# EAGLE design Robot_Psoc (EAGLE 7.5.0)
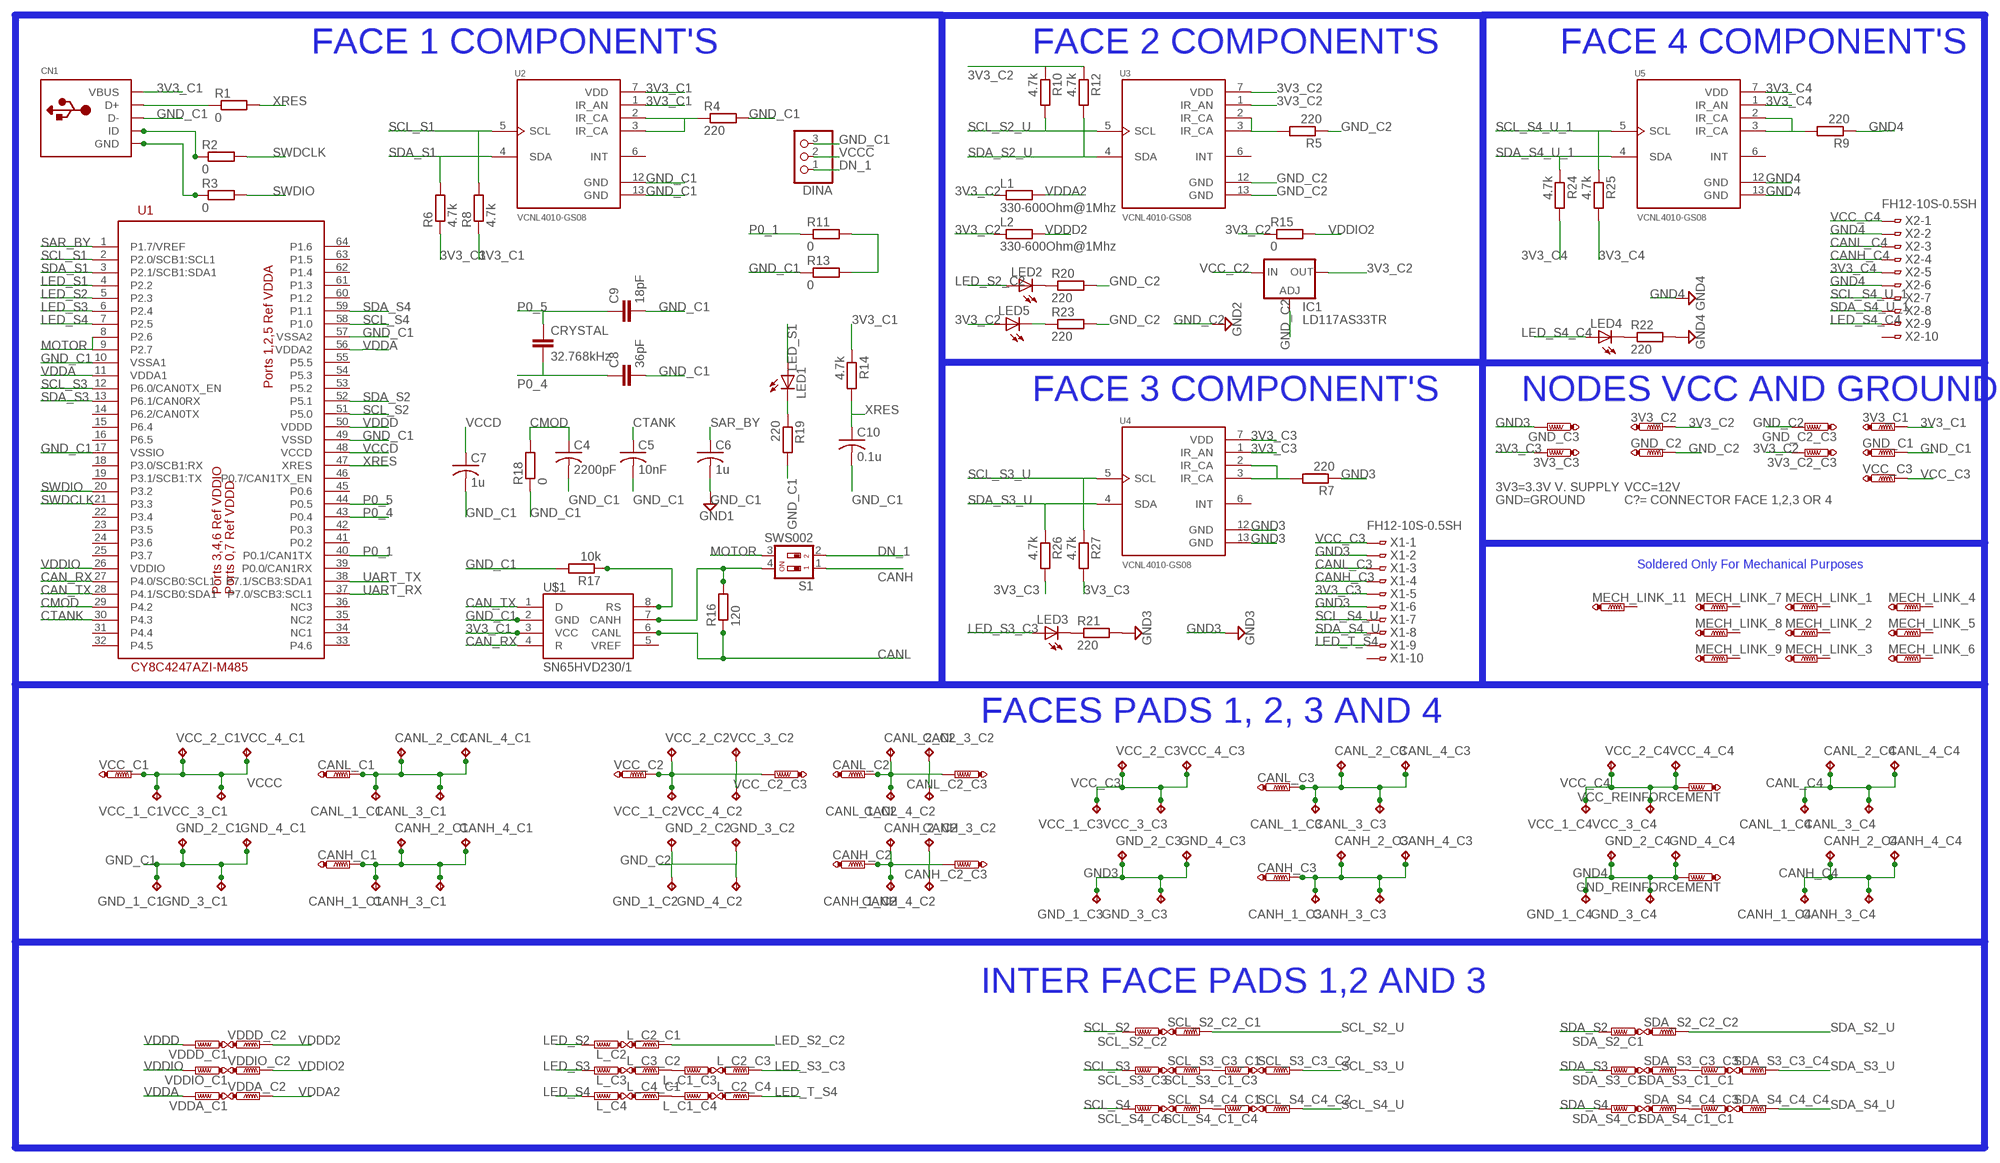
[diagram p0: schematic, sheet 1]

## Parts
3V3_C1  PTR1TP11R  [TP11R]
3V3_C2  PTR1TP11R  [TP11R]
3V3_C2_C3  PTR1TP11R  [TP11R]
3V3_C3  PTR1TP11R  [TP11R]
C4  2200pF  C-USC0805  [C0805]
C5  10nF  C-USC0805  [C0805]
C6  1u  C-USC0805  [C0805]
C7  1u  C-USC0805  [C0805]
C8  36pF  C-EUC0805  [C0805]
C9  18pF  C-EUC0805  [C0805]
C10  0.1u  C-USC0805  [C0805]
CANH_1_C1  TPB2,54  [B2,54]
CANH_1_C2  TPB2,54  [B2,54]
CANH_1_C3  TPB2,54  [B2,54]
CANH_1_C4  TPB2,54  [B2,54]
CANH_2_C1  TPB2,54  [B2,54]
CANH_2_C2  TPB2,54  [B2,54]
CANH_2_C3  TPB2,54  [B2,54]
CANH_2_C4  TPB2,54  [B2,54]
CANH_3_C1  TPB2,54  [B2,54]
CANH_3_C2  TPB2,54  [B2,54]
CANH_3_C3  TPB2,54  [B2,54]
CANH_3_C4  TPB2,54  [B2,54]
CANH_4_C1  TPB2,54  [B2,54]
CANH_4_C2  TPB2,54  [B2,54]
CANH_4_C3  TPB2,54  [B2,54]
CANH_4_C4  TPB2,54  [B2,54]
CANH_C1  PTR1TP11R  [TP11R]
CANH_C2  PTR1TP11R  [TP11R]
CANH_C2_C3  PTR1TP11R  [TP11R]
CANH_C3  PTR1TP11R  [TP11R]
CANL_1_C1  TPB2,54  [B2,54]
CANL_1_C2  TPB2,54  [B2,54]
CANL_1_C3  TPB2,54  [B2,54]
CANL_1_C4  TPB2,54  [B2,54]
CANL_2_C1  TPB2,54  [B2,54]
CANL_2_C2  TPB2,54  [B2,54]
CANL_2_C3  TPB2,54  [B2,54]
CANL_2_C4  TPB2,54  [B2,54]
CANL_3_C1  TPB2,54  [B2,54]
CANL_3_C2  TPB2,54  [B2,54]
CANL_3_C3  TPB2,54  [B2,54]
CANL_3_C4  TPB2,54  [B2,54]
CANL_4_C1  TPB2,54  [B2,54]
CANL_4_C2  TPB2,54  [B2,54]
CANL_4_C3  TPB2,54  [B2,54]
CANL_4_C4  TPB2,54  [B2,54]
CANL_C1  PTR1TP11R  [TP11R]
CANL_C2  PTR1TP11R  [TP11R]
CANL_C2_C3  PTR1TP11R  [TP11R]
CANL_C3  PTR1TP11R  [TP11R]
CN1  USBMINIB  [USB-MINIB]
CRYSTAL  32.768kHz  C-EUC0603  [C0603]
DINA  PINHD-1X3  [1X03]
GND_1_C1  TPB2,54  [B2,54]
GND_1_C2  TPB2,54  [B2,54]
GND_1_C3  TPB2,54  [B2,54]
GND_1_C4  TPB2,54  [B2,54]
GND_2_C1  TPB2,54  [B2,54]
GND_2_C2  TPB2,54  [B2,54]
GND_2_C3  TPB2,54  [B2,54]
GND_2_C4  TPB2,54  [B2,54]
GND_3_C1  TPB2,54  [B2,54]
GND_3_C2  TPB2,54  [B2,54]
GND_3_C3  TPB2,54  [B2,54]
GND_3_C4  TPB2,54  [B2,54]
GND_4_C1  TPB2,54  [B2,54]
GND_4_C2  TPB2,54  [B2,54]
GND_4_C3  TPB2,54  [B2,54]
GND_4_C4  TPB2,54  [B2,54]
GND_C1  PTR1TP11R  [TP11R]
GND_C2  PTR1TP11R  [TP11R]
GND_C2_C3  PTR1TP11R  [TP11R]
GND_C3  PTR1TP11R  [TP11R]
GND_REINFORCEMENT  PTR1TP11R  [TP11R]
IC1  LD117AS33TR  [SOT223]
L1  330-600Ohm@1Mhz  R-EU_R0805  [R0805]
L2  330-600Ohm@1Mhz  R-EU_R0805  [R0805]
L_C1_C3  PTR1TP11R  [TP11R]
L_C1_C4  PTR1TP11R  [TP11R]
L_C2  PTR1TP11R  [TP11R]
L_C2_C1  PTR1TP11R  [TP11R]
L_C2_C3  PTR1TP11R  [TP11R]
L_C2_C4  PTR1TP11R  [TP11R]
L_C3  PTR1TP11R  [TP11R]
L_C3_C2  PTR1TP11R  [TP11R]
L_C4  PTR1TP11R  [TP11R]
L_C4_C1  PTR1TP11R  [TP11R]
LED1  LEDCHIPLED_0805  [CHIPLED_0805]
LED2  LEDCHIPLED_0805  [CHIPLED_0805]
LED3  LEDCHIPLED_0805  [CHIPLED_0805]
LED4  LEDCHIPLED_0805  [CHIPLED_0805]
LED5  LEDCHIPLED_0805  [CHIPLED_0805]
MECH_LINK_1  PTR1TP11R  [TP11R]
MECH_LINK_2  PTR1TP11R  [TP11R]
MECH_LINK_3  PTR1TP11R  [TP11R]
MECH_LINK_4  PTR1TP11R  [TP11R]
MECH_LINK_5  PTR1TP11R  [TP11R]
MECH_LINK_6  PTR1TP11R  [TP11R]
MECH_LINK_7  PTR1TP11R  [TP11R]
MECH_LINK_8  PTR1TP11R  [TP11R]
MECH_LINK_9  PTR1TP11R  [TP11R]
MECH_LINK_11  PTR1TP11R  [TP11R]
R1  0  R-EU_R0805  [R0805]
R2  0  R-EU_R0805  [R0805]
R3  0  R-EU_R0805  [R0805]
R4  220  R-EU_R0805  [R0805]
R5  220  R-EU_R0805  [R0805]
R6  4.7k  R-EU_R0805  [R0805]
R7  220  R-EU_R0805  [R0805]
R8  4.7k  R-EU_R0805  [R0805]
R9  220  R-EU_R0805  [R0805]
R10  4.7k  R-EU_R0805  [R0805]
R11  0  R-EU_R0805  [R0805]
R12  4.7k  R-EU_R0805  [R0805]
R13  0  R-EU_R0805  [R0805]
R14  4.7k  R-EU_R0805  [R0805]
R15  0  R-EU_R0805  [R0805]
R16  120  R-EU_R0805  [R0805]
R17  10k  R-EU_R0805  [R0805]
R18  0  R-EU_R0805  [R0805]
R19  220  R-EU_R0805  [R0805]
R20  220  R-EU_R0805  [R0805]
R21  220  R-EU_R0805  [R0805]
R22  220  R-EU_R0805  [R0805]
R23  220  R-EU_R0805  [R0805]
R24  4.7k  R-EU_R0805  [R0805]
R25  4.7k  R-EU_R0805  [R0805]
R26  4.7k  R-EU_R0805  [R0805]
R27  4.7k  R-EU_R0805  [R0805]
S1  SWS002  [SMS-002]
SCL_S2_C2  PTR1TP11R  [TP11R]
SCL_S2_C2_C1  PTR1TP11R  [TP11R]
SCL_S3_C1_C3  PTR1TP11R  [TP11R]
SCL_S3_C3  PTR1TP11R  [TP11R]
SCL_S3_C3_C1  PTR1TP11R  [TP11R]
SCL_S3_C3_C2  PTR1TP11R  [TP11R]
SCL_S4_C1_C4  PTR1TP11R  [TP11R]
SCL_S4_C4  PTR1TP11R  [TP11R]
SCL_S4_C4_C1  PTR1TP11R  [TP11R]
SCL_S4_C4_C2  PTR1TP11R  [TP11R]
SDA_S2_C1  PTR1TP11R  [TP11R]
SDA_S2_C2_C2  PTR1TP11R  [TP11R]
SDA_S3_C1  PTR1TP11R  [TP11R]
SDA_S3_C1_C1  PTR1TP11R  [TP11R]
SDA_S3_C3_C3  PTR1TP11R  [TP11R]
SDA_S3_C3_C4  PTR1TP11R  [TP11R]
SDA_S4_C1  PTR1TP11R  [TP11R]
SDA_S4_C1_C1  PTR1TP11R  [TP11R]
SDA_S4_C4_C3  PTR1TP11R  [TP11R]
SDA_S4_C4_C4  PTR1TP11R  [TP11R]
U1  CY8C4247AZI-M485  [TQFP64-10X10]
U2  VCNL4010-GS08  [XDCR_VCNL4010-GS08]
U3  VCNL4010-GS08  [XDCR_VCNL4010-GS08]
U4  VCNL4010-GS08  [XDCR_VCNL4010-GS08]
U5  VCNL4010-GS08  [XDCR_VCNL4010-GS08]
U$1  SN65HVD230/1  [SO8]
VCC_1_C1  TPB2,54  [B2,54]
VCC_1_C2  TPB2,54  [B2,54]
VCC_1_C3  TPB2,54  [B2,54]
VCC_1_C4  TPB2,54  [B2,54]
VCC_2_C1  TPB2,54  [B2,54]
VCC_2_C2  TPB2,54  [B2,54]
VCC_2_C3  TPB2,54  [B2,54]
VCC_2_C4  TPB2,54  [B2,54]
VCC_3_C1  TPB2,54  [B2,54]
VCC_3_C2  TPB2,54  [B2,54]
VCC_3_C3  TPB2,54  [B2,54]
VCC_3_C4  TPB2,54  [B2,54]
VCC_4_C1  TPB2,54  [B2,54]
VCC_4_C2  TPB2,54  [B2,54]
VCC_4_C3  TPB2,54  [B2,54]
VCC_4_C4  TPB2,54  [B2,54]
VCC_C1  PTR1TP11R  [TP11R]
VCC_C2  PTR1TP11R  [TP11R]
VCC_C2_C3  PTR1TP11R  [TP11R]
VCC_C3  PTR1TP11R  [TP11R]
VCC_REINFORCEMENT  PTR1TP11R  [TP11R]
VDDA_C1  PTR1TP11R  [TP11R]
VDDA_C2  PTR1TP11R  [TP11R]
VDDD_C1  PTR1TP11R  [TP11R]
VDDD_C2  PTR1TP11R  [TP11R]
VDDIO_C1  PTR1TP11R  [TP11R]
VDDIO_C2  PTR1TP11R  [TP11R]
X1  FH12-10S-0.5SH  [FH12-10S-0.5SH]
X2  FH12-10S-0.5SH  [FH12-10S-0.5SH]

## Nets
3V3_C1: 3V3_C1.TP CN1.VBUS R6.1 R8.1 R14.1 U2.1(IR_AN) U2.7(VDD) U$1.3(VCC)
3V3_C2: 3V3_C2.TP 3V3_C2_C3.TP IC1.4(OUT) L1.1 L2.1 LED5.A R10.1 R12.1 R15.1 U3.1(IR_AN) U3.7(VDD)
3V3_C3: 3V3_C3.TP R26.2 R27.2 U4.1(IR_AN) U4.7(VDD) X1.5
3V3_C4: R24.2 R25.2 U5.1(IR_AN) U5.7(VDD) X2.5
CAN_RX: U1.27(P4.0/SCB0:SCL1) U$1.4(R)
CAN_TX: U1.28(P4.1/SCB0:SDA1) U$1.1(D)
CANH: CANH_1_C1.TP CANH_2_C1.TP CANH_3_C1.TP CANH_4_C1.TP CANH_C1.TP S1.1
CANH_C3: CANH_1_C3.TP CANH_2_C3.TP CANH_3_C3.TP CANH_4_C3.TP CANH_C3.TP X1.4
CANH_C4: CANH_1_C4.TP CANH_2_C4.TP CANH_3_C4.TP CANH_4_C4.TP X2.4
CANL: CANL_1_C1.TP CANL_2_C1.TP CANL_3_C1.TP CANL_4_C1.TP CANL_C1.TP R16.1 U$1.6(CANL)
CANL_C3: CANL_1_C3.TP CANL_2_C3.TP CANL_3_C3.TP CANL_4_C3.TP CANL_C3.TP X1.3
CANL_C4: CANL_1_C4.TP CANL_2_C4.TP CANL_3_C4.TP CANL_4_C4.TP X2.3
CMOD: C4.1 R18.2 U1.29(P4.2)
CTANK: C5.1 U1.30(P4.3)
DN_1: DINA.1 S1.2
GND3: GND_1_C3.TP GND_2_C3.TP GND_3_C3.TP GND_4_C3.TP GND_C3.TP R7.1 R21.2 U4.12(GND) U4.13(GND) X1.2 X1.6
GND4: GND_1_C4.TP GND_2_C4.TP GND_3_C4.TP GND_4_C4.TP GND_REINFORCEMENT.TP R9.1 R22.2 U5.12(GND) U5.13(GND) X2.2 X2.6
GND_C1: C4.2 C5.2 C6.2 C7.2 C8.2 C9.2 C10.2 CN1.D- DINA.3 GND_1_C1.TP GND_2_C1.TP GND_3_C1.TP GND_4_C1.TP GND_C1.TP R4.2 R13.1 R17.2 R18.1 R19.2 U1.10(VSSA1) U1.17(VSSIO) U1.49(VSSD) U1.57(VSSA2) U2.12(GND) U2.13(GND) U$1.2(GND) ; supply symbol labelled GND1
GND_C2: GND_1_C2.TP GND_2_C2.TP GND_3_C2.TP GND_4_C2.TP GND_C2.TP GND_C2_C3.TP IC1.1(ADJ) R5.1 R20.2 R23.2 U3.12(GND) U3.13(GND) ; supply symbol labelled GND2
LED_S1: LED1.A U1.4(P2.2)
LED_S2: L_C2.TP U1.5(P2.3)
LED_S2_C2: L_C2_C1.TP LED2.A
LED_S3: L_C3.TP U1.6(P2.4)
LED_S3_C3: L_C2_C3.TP LED3.A
LED_S4: L_C4.TP U1.7(P2.5)
LED_S4_C4: LED4.A X2.9
LED_T_S4: L_C2_C4.TP X1.9
MOTOR: S1.3 U1.8(P2.6) U1.9(P2.7)
N$1: CN1.D+ R1.1
N$2: CN1.ID R2.1
N$3: CN1.GND R3.1
N$4: R11.2 R13.2
N$5: R16.2 S1.4 U$1.7(CANH)
N$7: CANH_1_C2.TP CANH_2_C2.TP CANH_3_C2.TP CANH_4_C2.TP CANH_C2.TP CANH_C2_C3.TP
N$8: R7.2 U4.2(IR_CA) U4.3(IR_CA)
N$9: R17.1 U$1.8(RS)
N$10: SDA_S3_C1_C1.TP SDA_S3_C3_C3.TP
N$14: LED1.C R19.1
N$15: LED2.C R20.1
N$16: LED3.C R21.1
N$17: LED4.C R22.1
N$18: LED5.C R23.1
N$20: L_C1_C4.TP L_C4_C1.TP
N$21: R4.1 U2.2(IR_CA) U2.3(IR_CA)
N$22: L_C1_C3.TP L_C3_C2.TP
N$26: SCL_S3_C1_C3.TP SCL_S3_C3_C1.TP
N$27: SCL_S4_C1_C4.TP SCL_S4_C4_C1.TP
N$32: CANL_1_C2.TP CANL_2_C2.TP CANL_3_C2.TP CANL_4_C2.TP CANL_C2.TP CANL_C2_C3.TP
N$43: R5.2 U3.2(IR_CA) U3.3(IR_CA)
N$44: SDA_S4_C1_C1.TP SDA_S4_C4_C3.TP
N$46: R9.2 U5.2(IR_CA) U5.3(IR_CA)
P0_1: R11.1 U1.40(P0.1/CAN1TX)
P0_4: C8.1 CRYSTAL.2 U1.43(P0.4)
P0_5: C9.1 CRYSTAL.1 U1.44(P0.5)
SAR_BY: C6.1 U1.1(P1.7/VREF)
SCL_S1: R8.2 U1.2(P2.0/SCB1:SCL1) U2.5(SCL)
SCL_S2: SCL_S2_C2.TP U1.51(P5.0)
SCL_S2_U: R10.2 SCL_S2_C2_C1.TP U3.5(SCL)
SCL_S3: SCL_S3_C3.TP U1.12(P6.0/CAN0TX_EN)
SCL_S3_U: R27.1 SCL_S3_C3_C2.TP U4.5(SCL)
SCL_S4: SCL_S4_C4.TP U1.58(P1.0)
SCL_S4_U: SCL_S4_C4_C2.TP X1.7
SCL_S4_U_1: R25.1 U5.5(SCL) X2.7
SDA_S1: R6.2 U1.3(P2.1/SCB1:SDA1) U2.4(SDA)
SDA_S2: SDA_S2_C1.TP U1.52(P5.1)
SDA_S2_U: R12.2 SDA_S2_C2_C2.TP U3.4(SDA)
SDA_S3: SDA_S3_C1.TP U1.13(P6.1/CAN0RX)
SDA_S3_U: R26.1 SDA_S3_C3_C4.TP U4.4(SDA)
SDA_S4: SDA_S4_C1.TP U1.59(P1.1)
SDA_S4_U: SDA_S4_C4_C4.TP X1.8
SDA_S4_U_1: R24.1 U5.4(SDA) X2.8
SWDCLK: R2.2 U1.21(P3.3)
SWDIO: R3.2 U1.20(P3.2)
UART_RX: U1.37(P7.0/SCB3:SCL1)
UART_TX: U1.38(P7.1/SCB3:SDA1)
VCC_C2: IC1.3(IN) VCC_1_C2.TP VCC_2_C2.TP VCC_3_C2.TP VCC_4_C2.TP VCC_C2.TP VCC_C2_C3.TP
VCC_C3: VCC_1_C3.TP VCC_2_C3.TP VCC_3_C3.TP VCC_4_C3.TP VCC_C3.TP X1.1
VCC_C4: VCC_1_C4.TP VCC_2_C4.TP VCC_3_C4.TP VCC_4_C4.TP VCC_REINFORCEMENT.TP X2.1
VCCC: DINA.2 VCC_1_C1.TP VCC_2_C1.TP VCC_3_C1.TP VCC_4_C1.TP VCC_C1.TP
VCCD: C7.1 U1.48(VCCD)
VDDA: U1.11(VDDA1) U1.56(VDDA2) VDDA_C1.TP
VDDA2: L1.2 VDDA_C2.TP
VDDD: U1.50(VDDD) VDDD_C1.TP
VDDD2: L2.2 VDDD_C2.TP
VDDIO: U1.26(VDDIO) VDDIO_C1.TP
VDDIO2: R15.2 VDDIO_C2.TP
XRES: C10.1 R1.2 R14.2 U1.47(XRES)
Unconnected: MECH_LINK_1.TP MECH_LINK_2.TP MECH_LINK_3.TP MECH_LINK_4.TP MECH_LINK_5.TP MECH_LINK_6.TP MECH_LINK_7.TP MECH_LINK_8.TP MECH_LINK_9.TP MECH_LINK_11.TP U1.14(P6.2/CAN0TX) U1.15(P6.4) U1.16(P6.5) U1.18(P3.0/SCB1:RX) U1.19(P3.1/SCB1:TX) U1.22(P3.4) U1.23(P3.5) U1.24(P3.6) U1.25(P3.7) U1.31(P4.4) U1.32(P4.5) U1.33(P4.6) U1.34(NC1) U1.35(NC2) U1.36(NC3) U1.39(P0.0/CAN1RX) U1.41(P0.2) U1.42(P0.3) U1.45(P0.6) U1.46(P0.7/CAN1TX_EN) U1.53(P5.2) U1.54(P5.3) U1.55(P5.5) U1.60(P1.2) U1.61(P1.3) U1.62(P1.4) U1.63(P1.5) U1.64(P1.6) U2.6(INT) U3.6(INT) U4.6(INT) U5.6(INT) U$1.5(VREF) X1.10 X2.10

## Notes on the sheet
- FACE 1 COMPONENT'S | FACE 2 COMPONENT'S | FACE 4 COMPONENT'S
- FACE 3 COMPONENT'S | NODES VCC AND GROUND
- 3V3=3.3V V. SUPPLY | VCC=12V
- GND=GROUND | C?= CONNECTOR FACE 1,2,3 OR 4
- Soldered Only For Mechanical Purposes
- FACES PADS 1, 2, 3 AND 4
- INTER FACE PADS 1,2 AND 3

## Library data of the parts
3V3_C1 3V3_C2 3V3_C2_C3 3V3_C3 CANH_C1 CANH_C2 CANH_C2_C3 CANH_C3 CANL_C1 CANL_C2 CANL_C2_C3 CANL_C3 GND_C1 GND_C2 GND_C2_C3 GND_C3 GND_REINFORCEMENT L_C1_C3 L_C1_C4 L_C2 L_C2_C1 L_C2_C3 L_C2_C4 L_C3 L_C3_C2 L_C4 L_C4_C1 MECH_LINK_1-MECH_LINK_9 MECH_LINK_11 SCL_S2_C2 SCL_S2_C2_C1 SCL_S3_C1_C3 SCL_S3_C3 SCL_S3_C3_C1 SCL_S3_C3_C2 SCL_S4_C1_C4 SCL_S4_C4 SCL_S4_C4_C1 SCL_S4_C4_C2 SDA_S2_C1 SDA_S2_C2_C2 SDA_S3_C1 SDA_S3_C1_C1 SDA_S3_C3_C3 SDA_S3_C3_C4 SDA_S4_C1 SDA_S4_C1_C1 SDA_S4_C4_C3 SDA_S4_C4_C4 VCC_C1 VCC_C2 VCC_C2_C3 VCC_C3 VCC_REINFORCEMENT VDDA_C1 VDDA_C2 VDDD_C1 VDDD_C2 VDDIO_C1 VDDIO_C2 = testpad:PTR1: TEST PIN
C4-C7 C10 = rcl:C-US: CAPACITOR, American symbol
C8 C9 CRYSTAL = rcl:C-EU: CAPACITOR, European symbol
CANH_1_C1-CANH_1_C4 CANH_2_C1-CANH_2_C4 CANH_3_C1-CANH_3_C4 CANH_4_C1-CANH_4_C4 CANL_1_C1-CANL_1_C4 CANL_2_C1-CANL_2_C4 CANL_3_C1-CANL_3_C4 CANL_4_C1-CANL_4_C4 GND_1_C1-GND_1_C4 GND_2_C1-GND_2_C4 GND_3_C1-GND_3_C4 GND_4_C1-GND_4_C4 VCC_1_C1-VCC_1_C4 VCC_2_C1-VCC_2_C4 VCC_3_C1-VCC_3_C4 VCC_4_C1-VCC_4_C4 = testpad:TP: Test pad
CN1 = adafruit:USB: USB Connectors USBMINIB - Surface Mount Female Mini-B USB Connector 4UConnector: 06564 By microbuilder.eu Thru-hole RA Female Mini-B USB Connector 4UConnector: 18732 By ladyada.net
DINA = pinhead:PINHD-1X3: PIN HEADER
IC1 = v-reg:LD117A?*: Low drop fixed and adjustable positive voltage regulators 1 A Source: http://www.st.com/stonline/products/literature/ds/7194/ld1117axx.pdf
L1 L2 R1-R27 = rcl:R-EU_: RESISTOR, European symbol
LED1-LED5 = adafruit:LED: LED OSRAM: - CHIPLED LG R971, LG N971, LY N971, LG Q971, LY Q971, LO R971, LY R971 LH N974, LH R974 LS Q976, LO Q976, LY Q976 LO Q996 - Hyper CHIPLED LW Q18S LB Q993, LB Q99A, LB R99A - SideLED LS A670, LO A670, LY A670, LG A670, LP A670 LB A673, LV A673, LT A673, LW A673 LH A674 LY A675 LS A676, LA A676, LO A676, LY A676, LW A676 LS A679, LY A679, LG A679 - Hyper Micro SIDELED® LS Y876, LA Y876, LO Y876, LY Y876 LT Y87S - SmartLED LW L88C, LW L88S LB L89C, LB L89S, LG L890 LS L89K, LO L89K, LY L89K LS L896, LA L896, LO L896, LY L896 - TOPLED LS T670, LO T670, LY T670, LG T670, LP T670 LSG T670, LSP T670, LSY T670, LOP T670, LYG T670 LG T671, LOG T671, LSG T671 LB T673, LV T673, LT T673, LW T673 LH T674 LS T676, LA T676, LO T676, LY T676, LB T676, LH T676, LSB T676, LW T676 LB T67C, LV T67C, LT T67C, LS T67K, LO T67K, LY T67K, LW E67C LS E67B, LA E67B, LO E67B, LY E67B, LB E67C, LV E67C, LT E67C LW T67C LS T679, LY T679, LG T679 LS T770, LO T770, LY T770, LG T770, LP T770 LB T773, LV T773, LT T773, LW T773 LH T774 LS E675, LA E675, LY E675, LS T675 LS T776, LA T776, LO T776, LY T776, LB T776 LHGB T686 LT T68C, LB T68C - Hyper Mini TOPLED® LB M676 - Mini TOPLED Santana® LG M470 LS M47K, LO M47K, LY M47K Source: http://www.osram.convergy.de/
S1 = smd-special:SWS002: SMD Dip Switch 2 pol.
U1 = CypressPSoC:CY8C4247AZI-M485
U2-U5 = VCNL4010-GS08:VCNL4010-GS08
U$1 = texas_instruments:SN65HVD230/1
X1 X2 = con-hirose:FH12-10S-0.5S: 0.5mm Pitch Connectors For FPC/FFC Source: Data sheet <http://www.hirose.co.jp/cataloge_hp/e58605370.pdf>; MPN: FH12-10S-0.5SH(55); OC_FARNELL: 1324540; OC_NEWARK: 34M6152

## Board
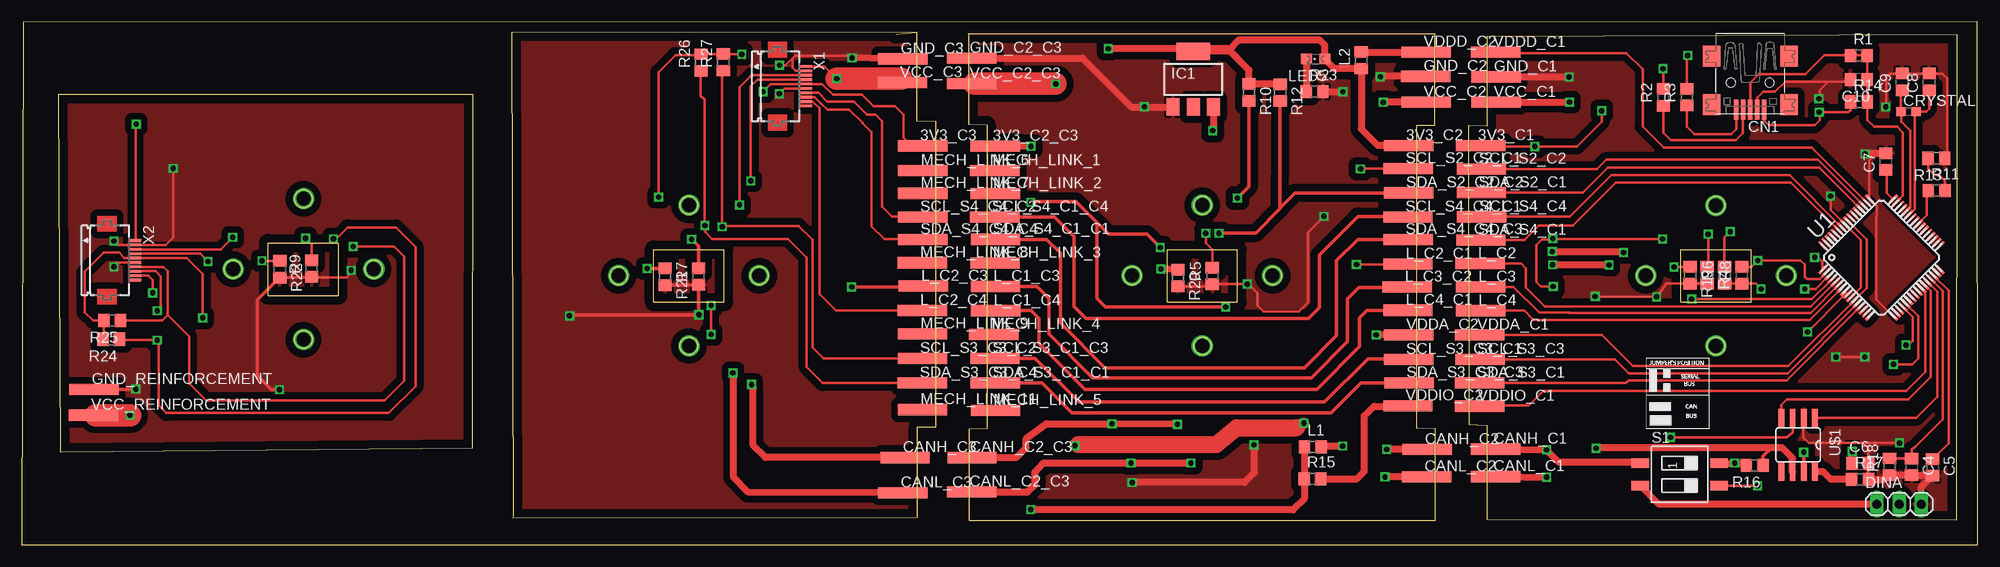
[diagram p1: board, top side]
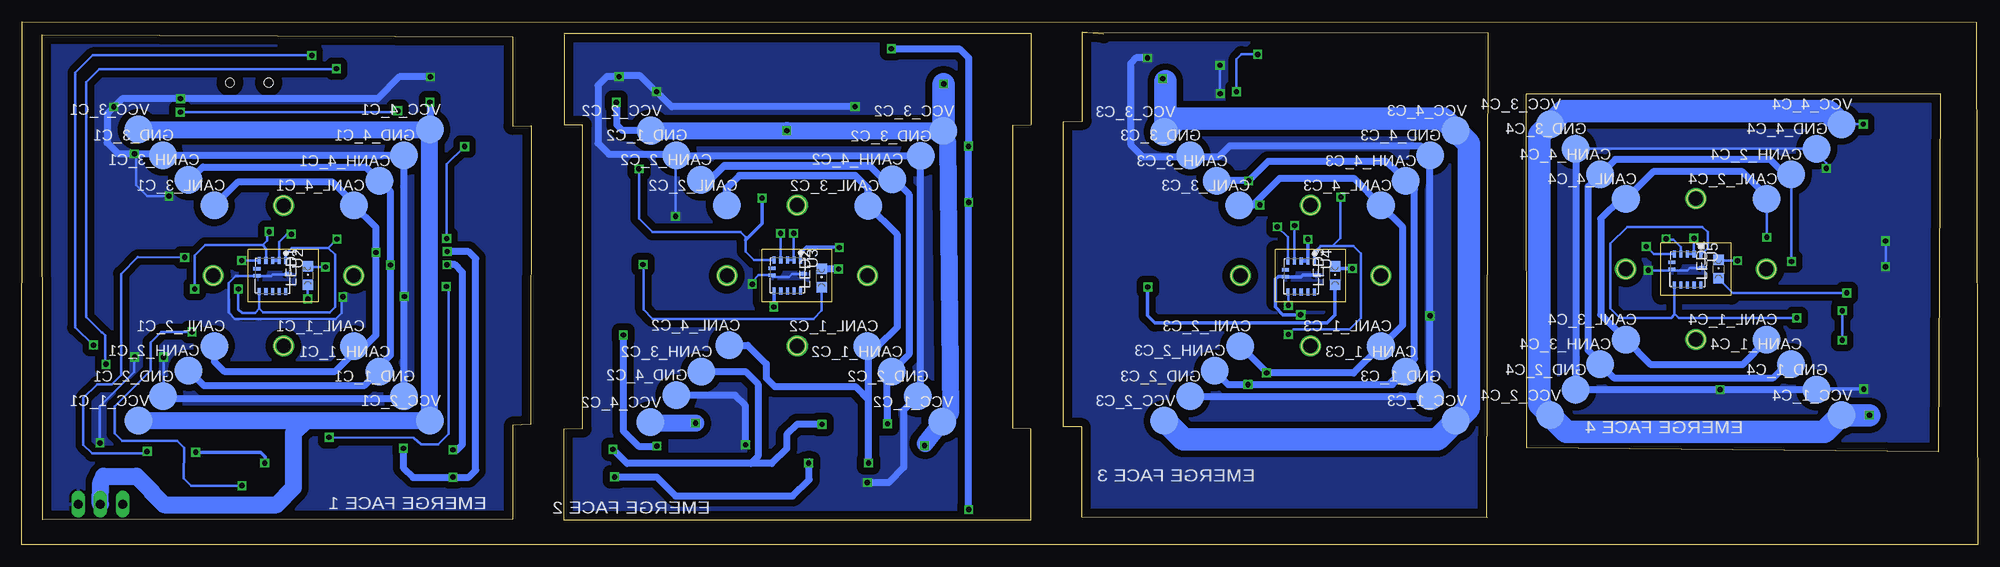
[diagram p2: board, bottom side, seen from below]

Size 222.46 x 59.49 mm. Coordinates in mm from the lower left corner, seen from the top.
Outline: 107.6,58.13 160.77,58.13
Outline: 101.8,58.34 101.8,48.21 103.99,48.13 103.96,13.41 101.88,13.39 101.88,3.1 55.78,3.05
Outline: 99.42,58.09 101.8,58.34
Outline: 101.8,58.34 55.73,58.27 55.85,3.15
Outline: 160.71,58.04 160.71,47.75 158.67,47.75 158.67,13.21 160.81,13.18 160.81,2.77 107.72,2.77 107.72,13.18 109.78,13.21 109.78,47.75 107.67,47.8 107.67,58.09
Outline: 0,0 222.46,0 222.41,59.49 0.15,59.44 0,0
Outline: 138.29,27.61 138.29,33.61 130.29,33.61 130.29,27.61 138.29,27.61
Outline: 4.4,10.55 4.17,51.27 51.35,51.27 51.25,10.98 4.4,10.55
Outline: 36,28.34 36,34.34 28,34.34 28,28.34 36,28.34
Outline: 79.87,27.61 79.87,33.61 71.87,33.61 71.87,27.61 79.87,27.61
Outline: 196.71,27.61 196.71,33.61 188.71,33.61 188.71,27.61 196.71,27.61
Outline: 166.65,47.65 164.54,47.68 164.59,13.67 166.62,13.56 166.62,2.9 220.09,2.79 220.14,58.04 166.65,57.81 166.65,47.65
Outline: circle at 126.29,30.61 radius 1
Outline: circle at 134.29,38.61 radius 1
Outline: circle at 142.29,30.61 radius 1
Outline: circle at 134.29,22.61 radius 1
Outline: circle at 24,31.34 radius 1
Outline: circle at 32,39.34 radius 1
Outline: circle at 40,31.34 radius 1
Outline: circle at 32,23.34 radius 1
Outline: circle at 67.87,30.61 radius 1
Outline: circle at 75.87,38.61 radius 1
Outline: circle at 83.87,30.61 radius 1
Outline: circle at 75.87,22.61 radius 1
Outline: circle at 184.71,30.61 radius 1
Outline: circle at 192.71,38.61 radius 1
Outline: circle at 200.71,30.61 radius 1
Outline: circle at 192.71,22.61 radius 1
Copper layers (1*16): Top 0.035mm / dielectric 1.5mm / Bottom 0.035mm
Design rules "default": minimum track width 10mil, minimum drill 24mil, track to track 8mil, track to pad 8mil, pad to pad 8mil, via to via 8mil, smd to smd 8mil, copper to edge 40mil, drill to drill 8mil, minimum pad ring 10mil, minimum via ring 8mil, stop-mask expansion 4mil, vias tented up to drill 0mil, thermal gap 10mil

### Footprints (pad centres in the part's own frame; a part is rotated, then mirrored left to right if it is on the bottom)
TP11R = smd 0.635 x 1.27: P$1 0.381,0; P$2 1.016,0; P$3 -0.254,0; P$4 -0.889,0; P$5 -1.524,0; P$6 1.613,0; P$7 2.21,0; P$8 -2.146,0; P$9 -2.769,0 | smd 1.1 x 1.1: TP 0,0
C0805 = smd 1.3 x 1.5: 1 -0.95,0; 2 0.95,0
B2,54 = smd 3.175 x 3.175 bottom: P$1 0,0 | smd 2.54 x 2.54 bottom: TP 0,0
USB-MINIB = smd 0.5 x 2.308: D+ 0,4.064; D- -0.8,4.064; GND 1.6,4.064; ID 0.8,4.064; VBUS -1.6,4.064 | smd 2 x 2.4: GND1 -4.4,-2; GND2 -4.4,3.5; GND3 4.4,3.5; GND4 4.4,-2 | hole 1: -2.2,1; 2.2,1
C0603 = smd 1.1 x 1: 1 -0.85,0; 2 0.85,0
1X03 = drill 1.016 long: 1 -2.54,0; 2 0,0; 3 2.54,0
SOT223 = smd 1.5 x 2: 1 -2.3,-3.15; 2 0,-3.15; 3 2.3,-3.15 | smd 3.8 x 2: 4 0,3.15
R0805 = smd 1.3 x 1.5: 1 -0.95,0; 2 0.95,0
CHIPLED_0805 = smd 1.2 x 1.2: A 0,-1.05; C 0,1.05
SMS-002 = smd 1.092 x 2.007: 1 -1.27,-4.496; 2 1.27,-4.496; 3 1.27,4.496; 4 -1.27,4.496
TQFP64-10X10 = smd 1.2 x 0.3: 1 -5.7,3.75; 2 -5.7,3.25; 3 -5.7,2.75; 4 -5.7,2.25; 5 -5.7,1.75; 6 -5.7,1.25; 7 -5.7,0.75; 8 -5.7,0.25; 9 -5.7,-0.25; 10 -5.7,-0.75; 11 -5.7,-1.25; 12 -5.7,-1.75; 13 -5.7,-2.25; 14 -5.7,-2.75; 15 -5.7,-3.25; 16 -5.7,-3.75; 33 5.7,-3.75; 34 5.7,-3.25; 35 5.7,-2.75; 36 5.7,-2.25; 37 5.7,-1.75; 38 5.7,-1.25; 39 5.7,-0.75; 40 5.7,-0.25; 41 5.7,0.25; 42 5.7,0.75; 43 5.7,1.25; 44 5.7,1.75; 45 5.7,2.25; 46 5.7,2.75; 47 5.7,3.25; 48 5.7,3.75 | smd 0.3 x 1.2: 17 -3.75,-5.7; 18 -3.25,-5.7; 19 -2.75,-5.7; 20 -2.25,-5.7; 21 -1.75,-5.7; 22 -1.25,-5.7; 23 -0.75,-5.7; 24 -0.25,-5.7; 25 0.25,-5.7; 26 0.75,-5.7; 27 1.25,-5.7; 28 1.75,-5.7; 29 2.25,-5.7; 30 2.75,-5.7; 31 3.25,-5.7; 32 3.75,-5.7; 49 3.75,5.7; 50 3.25,5.7; 51 2.75,5.7; 52 2.25,5.7; 53 1.75,5.7; 54 1.25,5.7; 55 0.75,5.7; 56 0.25,5.7; 57 -0.25,5.7; 58 -0.75,5.7; 59 -1.25,5.7; 60 -1.75,5.7; 61 -2.25,5.7; 62 -2.75,5.7; 63 -3.25,5.7; 64 -3.75,5.7
XDCR_VCNL4010-GS08 = smd 0.805 x 0.35: 1 -1.772,1.5; 2 -1.772,0.75; 3 -1.772,0; 4 -1.772,-0.75; 5 -1.772,-1.5; 7 1.772,-1.5; 8 1.772,-0.75; 9 1.772,0; 10 1.772,0.75; 11 1.772,1.5 | smd 0.4 x 0.805: 6 -0.8,-1.772; 12 -0.175,1.772; 13 0,-1.772
SO8 = smd 0.66 x 2.032: 1 -1.905,-3.073; 2 -0.635,-3.073; 3 0.635,-3.073; 4 1.905,-3.073; 5 1.905,3.073; 6 0.635,3.073; 7 -0.635,3.073; 8 -1.905,3.073
FH12-10S-0.5SH = smd 0.3 x 1.3: 1 -2.25,3.25; 2 -1.75,3.25; 3 -1.25,3.25; 4 -0.75,3.25; 5 -0.25,3.25; 6 0.25,3.25; 7 0.75,3.25; 8 1.25,3.25; 9 1.75,3.25; 10 2.25,3.25

### Placement (x,y rotation side)
3V3_C1  166.19,45.42 0 top
3V3_C2  158.01,45.42 0 top
3V3_C2_C3  111,45.36 0 top
3V3_C3  102.74,45.39 0 top
C4  214.96,8.84 270 top
C5  217.35,8.79 270 top
C6  209.12,9.25 0 top
C7  212.04,43.59 90 top
C8  216.97,52.65 90 top
C9  213.89,52.65 90 top
C10  208.94,52.93 180 top
CANH_1_C1  181.79,19.69 0 top
CANH_1_C2  123.49,19.69 0 top
CANH_1_C3  65.07,19.69 0 top
CANH_1_C4  21.21,20.55 0 top
CANH_2_C1  203.5,19.81 0 top
CANH_2_C2  145.21,41.53 0 top
CANH_2_C3  86.79,19.81 0 top
CANH_2_C4  21.21,42.14 0 top
CANH_3_C1  203.5,41.53 0 top
CANH_3_C2  145.16,19.69 0 top
CANH_3_C3  86.54,41.4 0 top
CANH_3_C4  42.93,20.55 0 top
CANH_4_C1  181.79,41.4 0 top
CANH_4_C2  123.44,41.58 0 top
CANH_4_C3  65.07,41.4 0 top
CANH_4_C4  42.93,42.14 0 top
CANH_C1  167.92,10.87 0 top
CANH_C2  160.12,10.82 0 top
CANH_C2_C3  108.36,9.91 0 top
CANH_C3  100.74,9.91 0 top
CANL_1_C1  184.71,22.61 0 top
CANL_1_C2  126.29,22.61 0 top
CANL_1_C3  67.87,22.61 0 top
CANL_1_C4  24,23.34 0 top
CANL_2_C1  200.58,22.61 0 top
CANL_2_C2  142.29,38.61 0 top
CANL_2_C3  83.87,22.61 0 top
CANL_2_C4  24,39.34 0 top
CANL_3_C1  200.58,38.61 0 top
CANL_3_C2  126.19,38.58 0 top
CANL_3_C3  84,38.61 0 top
CANL_3_C4  40.01,23.34 0 top
CANL_4_C1  184.71,38.61 0 top
CANL_4_C2  141.99,22.68 0 top
CANL_4_C3  67.87,38.61 0 top
CANL_4_C4  40.01,39.34 0 top
CANL_C1  167.92,7.75 0 top
CANL_C2  160.07,7.72 0 top
CANL_C2_C3  108.31,5.99 0 top
CANL_C3  100.48,5.89 0 top
CN1  196.6,53.57 180 top
CRYSTAL  214.6,49.28 0 top
DINA  213.54,4.6 0 top
GND_1_C1  178.99,16.89 0 top
GND_1_C2  148.01,44.32 0 top
GND_1_C3  62.28,16.89 0 top
GND_1_C4  18.29,17.63 0 top
GND_2_C1  206.43,16.89 0 top
GND_2_C2  120.57,16.89 0 top
GND_2_C3  89.59,16.89 0 top
GND_2_C4  45.72,17.63 0 top
GND_3_C1  206.43,44.32 0 top
GND_3_C2  120.22,44.22 0 top
GND_3_C3  89.59,44.32 0 top
GND_3_C4  45.72,45.06 0 top
GND_4_C1  178.99,44.32 0 top
GND_4_C2  148.01,17.02 0 top
GND_4_C3  62.28,44.32 0 top
GND_4_C4  18.29,45.06 0 top
GND_C1  167.97,53.24 0 top
GND_C2  159.97,53.29 0 top
GND_C2_C3  108.33,55.37 0 top
GND_C3  100.48,55.27 0 top
GND_REINFORCEMENT  8.46,17.65 0 top
IC1  133.25,52.96 0 top
L1  146.84,11.13 0 top
L2  152.35,55.12 90 top
L_C1_C3  111.02,29.39 0 top
L_C1_C4  111.05,26.62 0 top
L_C2  166.17,31.98 0 top
L_C2_C1  157.94,31.93 0 top
L_C2_C3  102.82,29.41 0 top
L_C2_C4  102.69,26.64 0 top
L_C3  166.19,29.31 0 top
L_C3_C2  157.84,29.31 0 top
L_C4  166.19,26.62 0 top
L_C4_C1  157.94,26.67 0 top
LED1  189.94,30.61 0 bottom
LED2  131.5,30.35 0 bottom
LED3  73.08,30.61 0 bottom
LED4  29.46,31.34 0 bottom
LED5  147.17,55.27 90 top
MECH_LINK_1  110.92,42.57 0 top
MECH_LINK_2  111,39.95 0 top
MECH_LINK_3  110.97,32.05 0 top
MECH_LINK_4  110.82,23.93 0 top
MECH_LINK_5  111.02,15.27 0 top
MECH_LINK_6  102.77,42.57 0 top
MECH_LINK_7  102.74,39.98 0 top
MECH_LINK_8  102.69,32.08 0 top
MECH_LINK_9  102.72,23.98 0 top
MECH_LINK_11  102.72,15.37 0 top
R1  208.94,55.65 0 top
R2  186.72,50.9 90 top
R3  189.38,50.93 90 top
R4  191.69,30.66 270 top
R5  135.41,30.58 90 top
R6  193.68,30.66 90 top
R7  76.96,30.51 90 top
R8  195.66,30.66 90 top
R9  32.97,31.42 90 top
R10  139.57,51.46 270 top
R11  217.81,40.28 0 top
R12  143.13,51.44 270 top
R13  217.78,43.97 180 top
R14  208.97,50.39 0 top
R15  146.79,7.49 0 top
R16  197.1,9.02 180 top
R17  209.09,7.44 0 top
R18  212.45,8.86 90 top
R19  189.76,30.66 270 top
R20  131.5,30.35 270 top
R21  73.15,30.48 270 top
R22  29.34,31.34 270 top
R23  147.04,51.56 0 top
R24  10.16,23.37 180 top
R25  10.26,25.5 180 top
R26  77.27,54.86 90 top
R27  79.78,54.89 90 top
S1  188.57,8 270 top
SCL_S2_C2  166.29,42.75 0 top
SCL_S2_C2_C1  157.96,42.8 0 top
SCL_S3_C1_C3  110.97,21.18 0 top
SCL_S3_C3  166.14,21.08 0 top
SCL_S3_C3_C1  158.01,21.08 0 top
SCL_S3_C3_C2  102.72,21.18 0 top
SCL_S4_C1_C4  110.92,37.29 0 top
SCL_S4_C4  166.34,37.31 0 top
SCL_S4_C4_C1  157.94,37.29 0 top
SCL_S4_C4_C2  102.74,37.29 0 top
SDA_S2_C1  166.29,40.06 0 top
SDA_S2_C2_C2  158.01,40.03 0 top
SDA_S3_C1  166.09,18.39 0 top
SDA_S3_C1_C1  111,18.39 0 top
SDA_S3_C3_C3  158.06,18.42 0 top
SDA_S3_C3_C4  102.69,18.39 0 top
SDA_S4_C1  166.24,34.65 0 top
SDA_S4_C1_C1  111.02,34.75 0 top
SDA_S4_C4_C3  157.96,34.72 0 top
SDA_S4_C4_C4  102.77,34.72 0 top
U1  211.53,32.66 45 top
U2  193.95,30.58 270 bottom
U3  135.38,30.63 270 bottom
U4  76.94,30.51 270 bottom
U5  32.99,31.32 270 bottom
U$1  202.06,11.35 180 top
VCC_1_C1  209.22,14.1 0 top
VCC_1_C2  117.78,13.97 0 top
VCC_1_C3  59.36,14.1 0 top
VCC_1_C4  15.49,14.71 0 top
VCC_2_C1  176.07,14.1 0 top
VCC_2_C2  150.93,47.12 0 top
VCC_2_C3  92.51,14.1 0 top
VCC_2_C4  48.64,14.71 0 top
VCC_3_C1  209.22,47.24 0 top
VCC_3_C2  117.68,47.07 0 top
VCC_3_C3  92.51,46.99 0 top
VCC_3_C4  48.64,47.85 0 top
VCC_4_C1  176.07,47.24 0 top
VCC_4_C2  151,13.92 0 top
VCC_4_C3  59.36,47.12 0 top
VCC_4_C4  15.49,47.85 0 top
VCC_C1  167.97,50.34 0 top
VCC_C2  159.99,50.34 0 top
VCC_C2_C3  108.33,52.45 0 top
VCC_C3  100.43,52.58 0 top
VCC_REINFORCEMENT  8.41,14.73 0 top
VDDA_C1  166.09,23.85 0 top
VDDA_C2  158.01,23.85 0 top
VDDD_C1  167.92,56.03 0 top
VDDD_C2  159.99,56.06 0 top
VDDIO_C1  166.12,15.75 0 top
VDDIO_C2  157.94,15.8 0 top
X1  85.95,52.17 270 top
X2  9.68,32.36 270 top

### Tracks (layer width: path | path; a pad name or v marks a point on that pad's centre or on a via)
3V3_C1  (via drill 0.6)
  Top 0.305: 208.03,50.38 R14.1 208.02,49.47 207.77,49.22 v204.44,49.22 | 204.55,49.17 v204.44,49.22 | v179.7,49.38 179.7,48.13 176.89,45.31 v172.11,45.31 | v172.11,45.31 167.26,45.31 166.93,45.64 166.42,45.64 3V3_C1.TP 166.29,45.31 v172.11,45.31 | CN1.VBUS 198.2,48.26 198.73,47.73 203.94,47.73 204.5,48.28 204.5,49.17 v204.44,49.22 | v186.64,34.77 174.32,34.8 v174.14,34.82 174.07,34.75 172.92,34.75 172.29,34.11 172.29,29.9 172.8,29.39 v174.19,29.39 | U$1.3 201.42,12.78 200.79,12.19 v187.53,12.19 | R6.1 R8.1 197.22,29.71 v197.84,29.08
  Bottom 0.305: v204.44,49.22 179.86,49.22 v179.7,49.38 | U2.7 195.45,26.85 | 195.45,26.85 195,26.39 187.48,26.39 186.84,27.03 186.84,33.02 187.6,33.78 187.63,33.78 | U2.1 192.46,33.1 191.77,33.78 187.63,33.78 | 187.63,33.78 v186.64,34.77 | v174.14,34.82 174.14,43.28 v172.11,45.31 | v187.53,12.19 177.9,12.17 177.06,11.38 175.13,11.38 173.91,12.6 173.91,29.11 v174.19,29.39 | v197.84,29.08 197.84,26.77 197.43,26.36 195.94,26.36 195.45,26.85
3V3_C2  (via drill 0.6)
  Top 0.406: 137.13,56.16 137.27,56.3 | v136.93,27.05 123.24,27.05 122.3,27.99 122.3,36.65 | 122.3,36.65 119.89,39.06 114.86,39.06 v114.76,38.96 | 122.3,36.65 123.62,35.33 127.96,35.33 v129.49,33.81
  Top 0.813: 3V3_C2.TP 157.99,45.44 154.2,45.44 152.35,47.3 L2.1 149.32,54.17 LED5.A 148.22,56.86 147.65,57.43 138.4,57.43 137.27,56.3 | 137.27,56.3 137.16,56.19 133.32,56.19 IC1.4 | R15.1 145.89,7.54 L1.1 145.89,5.22 144.6,3.94 114.81,3.94 v114.76,3.99 | v114.78,45.34 111.02,45.34 3V3_C2_C3.TP | R12.1 139.6,52.39 | 139.6,52.39 R10.1 139.57,54 137.27,56.3 | 139.6,52.39 139.6,54 137.16,56.44 v123.57,56.44
  Bottom 0.406: U3.7 136.88,27.1 v136.93,27.05 | U3.1 133.88,33.17 133.2,33.86 129.54,33.86 v129.49,33.81
  Bottom 0.813: v114.76,3.99 v114.76,38.96 114.76,45.31 v114.78,45.34 114.78,55.4 115.82,56.44 v123.57,56.44
3V3_C3  (via drill 0.6)
  Top 0.305: 3V3_C3.TP 102.67,45.31 101.29,45.31 100.3,46.3 100.3,48.92 99.31,49.91 96.85,49.91 95.55,51.21 92.25,51.21 91.04,52.42 X1.5 85.16,52.42 v84.3,51.56 | v81.89,55.8 79.82,55.8 R27.2 79.76,55.81 R26.2 77.18,55.73 74.35,55.73 72.42,53.8 v72.42,39.55 | v78.38,23.93 v78.38,27.23
  Bottom 0.305: v84.3,51.56 84.3,55.27 83.74,55.83 81.91,55.83 v81.89,55.8 | v78.38,23.93 77.83,24.49 71.48,24.49 70.15,25.81 70.15,33.12 70.99,33.96 74.75,33.96 75.44,33.28 U4.1 75.44,33.2 74.65,33.98 73.41,33.98 72.49,34.9 72.49,39.47 v72.42,39.55 | v78.38,27.23 78.38,28.68 U4.7
3V3_C4  (via drill 0.6)
  Top 0.305: R24.2 9.31,23.47 R25.2 8.08,25.5 7.14,26.44 7.14,31.06 9.3,33.22 11.07,33.22 11.66,32.64 12.9,32.64 X2.5 18.75,32.61 20.55,30.81 v20.55,25.81
  Bottom 0.305: v20.55,25.81 33.98,25.81 34.47,26.29 | 34.47,26.29 34.47,29.52 U5.7 | 31.4,33.09 U5.1 31.35,33.09 30.71,33.73 30.71,35.56 31.32,36.17 39.85,36.17 41.76,34.27 41.76,26.85 40.72,25.81 34.85,25.81 34.47,26.19 34.47,26.29
CAN_RX
  Top 0.305: U1.27 216.45,29.48 216.5,29.48 217.12,28.85 217.12,19.1 214.55,16.53 200.79,16.53 200.15,15.9 U$1.4 200.23,14.5
CAN_TX
  Top 0.305: U1.28 217.88,28.78 217.88,16.79 215.52,14.43 U$1.1
CANH  (via drill 0.6)
  Top 0.813: S1.1 183.97,9.37 174.83,9.37 v173.43,10.77 | 173.48,10.72 v173.43,10.77 | CANH_C1.TP 173.41,10.8 v173.43,10.77 | v180.54,31.83 174.14,31.83 v174.12,31.85
  Bottom 0.813: 204.01,19.81 CANH_2_C1.TP 201.75,18.06 183.54,18.06 181.91,19.69 CANH_1_C1.TP | CANH_1_C1.TP 180.52,19.69 | CANH_1_C1.TP 181.79,20.32 180.54,21.56 v180.54,31.83 180.54,40.16 CANH_4_C1.TP 183.36,42.98 201.88,42.98 203.33,41.53 CANH_3_C1.TP | v173.43,10.77 172.97,10.77 172.34,11.41 172.34,30.99 173.2,31.85 v174.12,31.85
CANH_C3  (via drill 0.6)
  Top 0.305: X1.4 83.66,52.92 82.91,52.17 v82.91,41.4
  Top 0.813: CANH_C3.TP 84.58,9.91 83.18,11.3 83.18,17.81 v83.01,18.21
  Bottom 0.305: CANH_4_C3.TP 65.07,41.43 | CANH_2_C3.TP 86.79,19.79 85.19,18.19 67,18.19 | 64.06,40.41 65.85,42.2
  Bottom 0.813: CANH_2_C3.TP 86.79,19.71 85.27,18.21 v83.01,18.21 66.55,18.21 CANH_1_C3.TP | CANH_3_C3.TP v82.91,41.4 80.7,43.61 67.26,43.61 65.85,42.2 65.07,41.43 | 67,18.19 64.06,21.13 64.06,40.41
CANH_C4  (via drill 0.6)
  Top 0.305: X2.4 20.26,33.11 v21.16,32.21
  Bottom 0.305: v21.16,32.21 21.16,42.09 CANH_2_C4.TP
  Bottom 0.813: CANH_1_C4.TP 21.67,20.55 23.29,18.92 41.3,18.92 CANH_3_C4.TP 42.93,20.75 44.3,22.12 44.3,40.77 CANH_4_C4.TP 41.22,43.84 23.6,43.84 21.89,42.14 CANH_2_C4.TP
CANL  (via drill 0.6)
  Top 0.305: 201.4,8.25 U$1.6 | 179.1,11.02 v179.07,10.95
  Top 0.406: 201.4,9.86 201.37,9.88 | R16.1 198.05,10.04 199.03,11.02
  Top 0.813: CANL_C1.TP v173.43,7.67 | v174.09,33.35 182.09,33.35 v182.19,33.25 | 201.37,9.88 200.23,11.02 199.03,11.02 179.1,11.02 | 201.4,8.25 201.4,9.86
  Bottom 0.305: 173.46,7.65 v173.43,7.67
  Bottom 0.813: CANL_3_C1.TP 197.94,41.25 187.1,41.25 184.71,38.86 CANL_4_C1.TP 182.19,36.09 v182.19,33.25 182.19,23.85 183.44,22.61 CANL_1_C1.TP 184.43,22.33 184.43,22.12 186.84,19.71 199.47,19.71 200.58,20.83 CANL_2_C1.TP | v173.43,7.67 171.63,7.67 170.84,8.46 170.84,32.54 171.65,33.35 v174.09,33.35 | v179.07,10.95 179.07,8.74 177.98,7.65 173.46,7.65
CANL_C3  (via drill 0.6)
  Top 0.305: X1.3 82.99,53.42 81.64,52.07 v81.64,38.66
  Top 0.813: CANL_C3.TP 82.63,5.97 80.95,7.65 80.95,19.15 v80.87,19.53
  Bottom 0.305: 83.95,38.66 CANL_3_C3.TP
  Bottom 0.813: CANL_2_C3.TP 80.75,19.48 v80.87,19.53 70.99,19.53 CANL_1_C3.TP 67.77,22.61 65.38,24.99 65.38,36.12 CANL_4_C3.TP 70.97,41.71 79.37,41.71 82.47,38.61 CANL_3_C3.TP | v81.64,38.66 83.95,38.66
CANL_C4  (via drill 0.6)
  Top 0.305: X2.3 22.61,33.61 v23.98,34.98
  Bottom 0.305: v23.98,34.98 23.98,39.32 CANL_2_C4.TP
  Bottom 0.813: CANL_2_C4.TP 24,39.7 26.75,42.44 36.91,42.44 CANL_4_C4.TP 40.59,39.34 42.85,37.08 42.85,26.19 CANL_3_C4.TP 37.13,20.47 26.75,20.47 24,23.22 CANL_1_C4.TP
CMOD
  Top 0.305: U1.29 218.52,28.85 218.49,14.22 215.39,11.12 214.98,10.85 C4.1 | 214.58,9.81 R18.2
  Top 0.813: 214.58,9.81 C4.1
CTANK
  Top 0.305: U1.30 219.18,28.91 219.18,11.54 C5.1
DN_1
  Top 0.813: DINA.1 186.21,4.6 S1.2
GND3  (via drill 0.6)
  Top 0.305: 87.66,55.35 87.66,54.25 87.99,53.92 X1.2 88.08,53.92 | 87.66,55.35 87.93,55.63 94.21,55.63 v94.44,55.4 | X1.6 86.74,51.92 v86.16,51.33 | v86.18,54.56 86.87,54.56 87.66,55.35
  Top 0.406: R21.2 73.18,29.56 R7.1 76.99,29.53 v76.99,26.19 | v77.01,26.14 62.38,26.14 v62.28,26.03
  Top 0.813: GND_C3.TP v94.44,55.4
  Bottom 0.305: v86.16,51.33 86.16,54.53 v86.18,54.56
  Bottom 0.406: U4.12 76.74,30.68 76.96,30.45 78.66,30.45 U4.13 79.55,30.5 79.86,30.2 79.86,27.03 78.99,26.16 77.04,26.16 | 77.04,26.16 77.01,26.16 v76.99,26.19 | 77.04,26.16 v77.01,26.14
  Bottom 0.813: GND_2_C3.TP GND_1_C3.TP v62.28,26.03 GND_4_C3.TP 63.35,45.39 85.06,45.39 86.28,44.17 89.74,44.17 | v94.44,55.4 95.71,55.4 96.34,54.76 96.34,45.54 94.97,44.17 89.74,44.17 | 89.74,44.17 GND_3_C3.TP
  pour Top (isolate 0.762): 55.7,3.1 102.01,2.62 101.85,13.26 104.04,13.13 103.73,48.03 101.9,47.85 101.8,58.24 55.7,58.34
  pour Bottom (isolate 0.762): 55.7,3 101.7,3.02 101.65,13.33 104.11,13.36 103.89,48.13 101.78,47.88 101.65,58.29 55.7,58.34
GND4  (via drill 0.6)
  Top 0.305: R22.2 32.89,30.39 R9.1 33.03,30.4 36.93,30.4 37.44,30.91 v37.44,31.22 | 29.34,17.68 v29.29,17.63 | v17.2,42.82 17.2,34.98 16.33,34.11 X2.2 10.9,34.11 v10.46,34.54 | v10.46,31.62 10.46,31.75 10.79,32.08 12.9,32.08 X2.6
  Top 0.406: 29.34,17.68 28.37,17.68 26.77,19.28 26.77,27.83 R22.2 | GND_REINFORCEMENT.TP 12.93,17.65 v12.93,17.7
  Bottom 0.305: GND_4_C4.TP 18.82,45.06 | 18.82,45.06 GND_3_C4.TP | U5.12 32.72,31.49 32.99,31.22 34.67,31.22 | 34.67,31.22 U5.13 | 34.67,31.22 v37.44,31.22 | v17.2,42.82 17.2,43.43 18.82,45.06 | v10.46,34.54 v10.46,31.62
  Bottom 0.406: v12.93,17.7 18.29,17.7 GND_1_C4.TP
  Bottom 0.813: GND_1_C4.TP v29.29,17.63 GND_2_C4.TP GND_3_C4.TP
  pour Top (isolate 0.762): 5.11,11 51.33,11 51.46,51.41 4.09,51.28 4.45,10.95
  pour Bottom (isolate 0.762): 5.11,10.8 51.33,10.92 51.46,51.31 4.34,51.08 4.45,11.05
GND_C1  (via drill 0.6)
  Top 0.305: 212.45,7.84 R18.1 213.21,7.89 | R17.2 209.97,8.97 C6.2 210.02,10.94 209.37,11.58 | U1.17 212.88,25.98 210.95,27.92 210.95,37.34 210.97,37.36 210.97,38.53 U1.49 210.15,43.73 210.92,44.5 212,44.5 C7.2 | U1.10 208.06,28.1 208.06,28.13 209.19,29.26 209.19,34.65 | 209.19,34.65 U1.57 | CN1.D- 197.41,50.88 198.07,51.54 199.42,51.54 200.58,52.7 207.76,52.7 C10.2 207.95,52.93 207.7,52.68 205.49,52.68 204.52,51.71 204.52,50.85 v204.42,50.75 | 215.14,7.84 C4.2 | 209.37,11.58 203.28,11.58 | 203.28,11.58 203.25,11.58 202.67,12.17 202.67,12.19 | 202.67,12.19 202.67,14.4 | 202.67,14.4 U$1.2 202.67,14.43 202.67,14.4 | R19.2 R4.2 187.09,29.71 v185.95,28.19 179.17,28.22 v178.97,28.25 | 209.19,34.65 209.19,34.67 205.79,38.08 205.79,39.62 v205.74,39.67 | R13.1 219,44.24 219,53.06 218.45,53.6 C8.2 C9.2 212.46,53.6 212.06,53.21 212.06,50.22 v212.01,49.81 | 202.67,12.19 203.28,11.58 | 209.37,11.58 213.56,11.58 v213.59,11.56 | v206.35,21.36 v209.63,21.36 206.37,21.36 v206.35,21.34
  Top 0.813: 215.14,7.84 C5.2 216.08,6.57 DINA.3 | C4.2 213.21,7.89 | R17.2 211.8,7.42 R18.1 | GND_C1.TP v176,53.24 | 212,44.5 v209.68,44.47
  Bottom 0.305: U2.12 193.93,30.76 194.11,30.58 U2.13 198.15,30.58 198.96,29.77 198.96,26.39 198.25,25.68 186.77,25.68 186.08,26.36 186.08,28.32 v185.95,28.19 | v205.74,39.67 208.23,39.67 209.45,40.89 209.45,44.25 v209.68,44.47 | v213.59,11.56 213.59,15.75 209.68,19.66 209.68,21.11 v209.63,21.36 | v206.35,21.36 v206.35,21.34 | v206.35,21.34 206.35,16.97 GND_2_C1.TP | v206.35,21.34 206.35,16.99 206.43,16.92
  Bottom 0.61: 178.61,43.94 GND_4_C1.TP
  Bottom 0.813: v176,53.24 179.53,53.24 182.02,50.75 v204.42,50.75 211.07,50.75 v212.01,49.81 212.78,49.05 212.78,45.75 211.53,44.5 v209.68,44.47 208.23,44.5 206.6,44.5 GND_3_C1.TP GND_4_C1.TP v178.97,28.25 GND_1_C1.TP 180.09,16.64 205,16.64 205.71,16.92 206.43,16.92
  pour Bottom (isolate 0.762): 166.7,57.94 166.7,48.08 164.69,47.65 164.62,13.36 166.67,13.36 166.67,2.79 219.89,2.79 219.89,57.94 168.38,58.04
  pour Top (isolate 0.762): 166.62,57.84 166.73,47.73 164.57,47.78 164.64,13.33 166.55,13.26 166.62,2.67 219.89,2.84 219.89,57.84
GND_C2  (via drill 0.6)
  Top 0.305: v139.37,29.64 v139.36,29.63 R5.1 135.18,29.4 R20.2 135.22,29.4 135.48,29.67 139.5,29.67 140.54,28.63 140.54,27.23 141.22,26.54 145.29,26.54 146.28,27.53 146.28,35.53 v148.11,37.36
  Top 0.813: GND_C2.TP 154.56,53.29 v154.53,53.26 | R23.2 v150.27,51.56 | GND_C2_C3.TP 120.65,55.37 126.21,49.81 127.66,49.81 | 127.66,49.81 IC1.1 | 127.66,49.81 v127.69,49.83 | v140.16,11.35 140.16,8.15 139.06,7.06 v126.29,7.06
  Bottom 0.305: U3.12 134.85,30.81 135.18,30.48 137,30.48 U3.13 137.18,30.66 138.66,30.66 139.37,29.95 v139.37,29.64 | v148.11,37.36 148.11,44.22 GND_1_C2.TP
  Bottom 0.406: 122.22,15.24 122.15,15.24 | 126.26,7.04 v126.29,7.06
  Bottom 0.813: 122.22,15.24 GND_2_C2.TP 120.7,17.02 120.22,17.02 GND_3_C2.TP 148.01,44.22 GND_1_C2.TP 148.11,44.42 155.68,44.42 156.92,45.67 156.92,52.27 155.93,53.26 v154.53,53.26 154.43,53.36 152.12,53.36 150.32,51.56 v150.27,51.56 148.54,49.83 v127.69,49.83 | v140.16,11.35 140.16,15.82 141.33,16.99 147.98,16.99 GND_4_C2.TP | 122.15,15.24 122.15,8.76 123.88,7.04 126.26,7.04
  pour Top (isolate 0.813): 107.72,2.84 160.78,2.82 160.78,13.28 158.75,13.26 158.75,47.78 160.78,47.75 160.78,58.22 107.62,58.24 107.62,47.57 109.8,47.57 109.8,12.95 107.72,13
  pour Bottom (isolate 0.813): 107.75,2.82 160.81,2.82 160.81,13.28 158.65,13.26 158.65,47.78 160.81,47.75 160.81,58.22 107.57,58.27 107.57,47.6 109.7,47.57 109.7,12.95 107.75,12.98
LED_S1  (via drill 0.6)
  Top 0.305: v189.94,27.94 203.62,27.94 U1.4
  Bottom 0.305: LED1.A v189.94,27.94
LED_S2
  Top 0.305: U1.5 203.49,27.1 173.25,27.1 171.09,29.26 171.09,31.44 170.56,31.98 L_C2.TP
LED_S2_C2  (via drill 0.6)
  Top 0.305: v151.82,31.88 157.89,31.88 L_C2_C1.TP
  Bottom 0.305: LED2.A 131.5,26.64 132.44,25.7 150.7,25.7 151.74,26.75 151.74,31.8 v151.82,31.88
LED_S3
  Top 0.305: U1.6 203.46,26.36 176.02,26.36 176,26.39 172.59,26.39 169.67,29.31 L_C3.TP
LED_S3_C3  (via drill 0.6)
  Top 0.406: v94.39,29.31 102.72,29.31 L_C2_C3.TP
  Bottom 0.406: LED3.A 73.08,26.14 74.02,25.2 93.57,25.2 94.44,26.06 94.44,29.26 v94.39,29.31
LED_S4
  Top 0.305: U1.7 203.38,25.58 175.36,25.58 175.34,25.55 171.96,25.55 170.89,26.62 L_C4.TP
LED_S4_C4  (via drill 0.6)
  Top 0.305: X2.9 14.35,30.61 14.86,30.1 14.86,28.68 v14.88,28.65
  Bottom 0.305: v14.88,28.65 27.82,28.65 LED4.A
LED_T_S4
  Top 0.305: X1.9 89.94,50.42 90.7,49.66 90.7,28.55 92.61,26.64 L_C2_C4.TP
MOTOR  (via drill 0.6)
  Top 0.305: U1.8 U1.9 207.37,28.46 v203.12,24.21 | v197.43,6.71 193.09,6.71 S1.3
  Bottom 0.305: v203.12,24.21 206.63,24.21 207.82,23.01 207.82,19.84 211.91,15.75 211.91,12.65 211.07,11.81 204.83,11.81 204.01,11 204.04,7.52 203.23,6.71 v197.43,6.71
N$1
  Top 0.305: CN1.D+ 196.6,52.55 197.59,53.54 202.84,53.54 205,55.7 209.16,55.7 R1.1
N$2
  Top 0.305: R2.1 186.72,46.91 187.58,46.05 194.97,46.05 195.76,46.84 195.76,49.47 CN1.ID
N$3
  Top 0.305: CN1.GND 195,47.3 194.44,46.74 190.25,46.74 189.41,47.57 189.41,49.95 R3.1
N$4
  Top 0.305: R13.2 216.83,42.78 217.58,42.04 218.08,42.04 218.72,41.4 218.72,40.32 R11.2
N$5  (via drill 0.6)
  Top 0.406: 202.74,8.33 U$1.7 v202.69,10.52 | 195.9,9.27 R16.2
  Top 0.813: S1.4 v194.84,9.27 195.9,9.27
  Bottom 0.406: v202.69,10.52 195.33,10.52 194.82,10.01 194.82,9.3 v194.84,9.27
N$7  (via drill 0.6)
  Top 0.813: CANH_C2_C3.TP 113.11,9.91 114.22,11.02 114.22,12.06 116.51,13.74 v124,13.74 124.03,13.72 v131.44,13.69 | CANH_C2.TP 155.27,10.82 v155.24,10.85
  Bottom 0.813: v124,13.74 124.05,19.13 CANH_1_C2.TP 121.56,21.61 121.56,39.88 123.37,41.68 124.56,41.68 125.98,43.1 142.65,43.1 144.22,41.53 CANH_2_C2.TP | v155.24,10.85 155.17,10.8 153.59,9.22 139.55,9.22 | v131.44,13.69 134.26,13.69 135.46,12.52 135.46,10.92 137.16,9.22 139.55,9.22 | 145.21,41.58 CANH_2_C2.TP | CANH_4_C2.TP 124.49,41.58 126.06,43.16 142.54,43.16 144.14,41.55 145.19,41.55 CANH_2_C2.TP | CANH_3_C2.TP 140.16,19.69 138.73,18.26 138.73,10.03 139.55,9.22
N$8  (via drill 0.6)
  Top 0.406: R7.2 76.96,33.96 v76.17,34.75
  Bottom 0.406: U4.3 U4.2 76.17,32.29 v76.17,34.75
N$9
  Top 0.813: R17.1 205.77,7.44 204.9,8.28 U$1.8
N$10
  Top 0.406: SDA_S3_C1_C1.TP 116.03,18.39 119.43,14.99 148.89,14.99 152.3,18.39 158.04,18.39 SDA_S3_C3_C3.TP
N$11  (via drill 0.6)
  other vias: 198.78,52.55
N$12  (via drill 0.6)
  other vias: 194.39,52.55
N$14  (via drill 0.6)
  Top 0.305: R19.1 188.07,31.61 v187.93,31.6
  Bottom 0.305: v187.93,31.6 189.88,31.6 LED1.C
N$15  (via drill 0.6)
  Top 0.813: v129.57,31.37 131.4,31.39 R20.1
  Bottom 0.813: LED2.C 129.7,31.4 v129.57,31.37
N$16  (via drill 0.6)
  Top 0.406: R21.1 71.16,31.43 v71.12,31.42
  Bottom 0.406: v71.12,31.42 72.84,31.42 LED3.C
N$17  (via drill 0.6)
  Top 0.305: R22.1 27.32,32.29 v27.3,32.31
  Bottom 0.305: v27.3,32.31 29.38,32.31 LED4.C
N$18
  Top 0.813: LED5.C 146.12,51.59 R23.1
N$20
  Top 0.406: L_C1_C4.TP 114.81,26.62 115.7,25.73 115.7,22.91 120.93,17.68 147.32,17.68 152.17,22.53 152.17,25.81 153.01,26.64 157.91,26.64 L_C4_C1.TP
N$21  (via drill 0.6)
  Top 0.305: v191.82,35.33 191.82,31.66 R4.1
  Bottom 0.305: U2.2 193.2,34.46 192.35,35.31 191.85,35.31 v191.82,35.33
  Bottom 0.406: U2.2 U2.3
N$22
  Top 0.406: L_C1_C3.TP 115.44,29.39 116.81,28.02 116.81,23.95 121.79,18.97 146.66,18.97 150.8,23.11 150.8,27.97 152.09,29.26 157.78,29.26 L_C3_C2.TP
N$23  (via drill 1.6)
  other vias: 200.71,30.61
N$24  (via drill 1.6)
  other vias: 192.71,38.61
N$25  (via drill 1.6)
  other vias: 184.71,30.61
N$26
  Top 0.406: SCL_S3_C1_C3.TP 115.26,21.18 120.22,16.23 148.18,16.23 153.09,21.13 157.96,21.13 SCL_S3_C3_C1.TP
N$27
  Top 0.406: SCL_S4_C1_C4.TP 117.45,37.29 119.68,35.05 119.68,27.13 121.06,25.76 146.35,25.76 147.57,26.97 147.57,32.94 151.97,37.34 157.89,37.34 SCL_S4_C4_C1.TP
N$28  (via drill 1.6)
  other vias: 192.68,22.61
N$30  (via drill 1.6)
  other vias: 126.26,30.61
N$31  (via drill 1.6)
  other vias: 134.26,38.63
N$32  (via drill 0.6)
  Top 0.813: CANL_C2_C3.TP 114.4,5.99 115.21,6.81 115.21,8.23 116.23,9.3 126.19,9.3 v126.16,9.27 v132.97,9.27 | CANL_C2.TP 155.07,7.72 v155.04,7.7
  Bottom 0.813: v126.16,9.27 126.16,16.48 | 126.16,16.48 126.16,22.48 126.26,22.58 | v155.04,7.7 150.27,7.7 148.11,5.54 134.8,5.54 132.92,7.39 132.92,9.45 v132.97,9.27 | CANL_4_C2.TP 139.9,22.68 137.79,20.57 137.79,18.95 136.83,17.98 127.66,17.98 126.16,16.48 | 126.19,38.71 126.19,40.56 127.63,42.01 140.84,42.01 142.29,40.56 CANL_2_C2.TP 142.24,38.66 142.24,40.59 140.82,42.01 127.69,42.01 126.19,40.51 CANL_3_C2.TP 122.88,35.28 122.88,24.77 125.07,22.58 126.26,22.58 | 126.26,22.58 CANL_1_C2.TP
N$33  (via drill 1.6)
  other vias: 142.27,30.61
N$34  (via drill 1.6)
  other vias: 134.26,22.61
N$35  (via drill 1.6)
  other vias: 67.87,30.61
N$36  (via drill 1.6)
  other vias: 75.87,38.63
N$37  (via drill 1.6)
  other vias: 83.87,30.61
N$38  (via drill 1.6)
  other vias: 75.87,22.61
N$39  (via drill 1.6)
  other vias: 24.03,31.37
N$40  (via drill 1.6)
  other vias: 32.03,39.37
N$41  (via drill 1.6)
  other vias: 40.03,31.37
N$42  (via drill 1.6)
  other vias: 32.03,23.34
N$43  (via drill 0.6)
  Top 0.305: R5.2 135.41,33.58 134.67,34.31 v134.67,35.43
  Bottom 0.305: v134.67,35.43 134.67,32.47 U3.2 U3.3
N$44
  Top 0.406: SDA_S4_C1_C1.TP 116.56,34.75 118.11,33.2 118.11,25.2 123.22,20.09 145.87,20.09 149.55,23.77 149.55,32.31 151.97,34.72 SDA_S4_C4_C3.TP
N$46  (via drill 0.6)
  Top 0.305: R9.2 32.97,34.16 v32.26,34.87
  Bottom 0.305: U5.3 U5.2 32.26,33.1 v32.26,34.87
P0_1
  Top 0.305: U1.40 216.71,37.49 216.71,40.14 R11.1
P0_4
  Top 0.305: U1.43 214.69,37.58 215.32,38.2 215.32,49.14 CRYSTAL.2 216.61,49.28 216.97,49.63 C8.1
P0_5
  Top 0.305: U1.44 214.34,37.93 214.83,38.43 214.83,47.09 213.77,48.16 213.77,49.26 CRYSTAL.1 213.75,51.56 C9.1
SAR_BY  (via drill 0.6)
  Top 0.305: v208.23,10.59 208,10.44 208,10.06 208.04,9.09 C6.1 | 203.78,32.66 v203.94,32.69 203.81,32.69 204.34,32.69 204.81,32.23 204.81,31.42 | 204.81,31.29 204.81,31.42 | U1.1 204.85,31.38 204.81,31.42
  Bottom 0.305: v203.94,32.69 209.27,32.72 211.18,30.81 211.18,19.33 212.27,18.24 213.92,18.24 215.47,16.69 215.47,11.35 214.48,10.36 208.31,10.36 v208.23,10.59
SCL_S1  (via drill 0.6)
  Top 0.305: U1.2 205.2,30.91 204.5,30.2 203.07,30.2 202.79,30.48 202.79,31.85 202.31,32.33 v197.46,32.33 196.73,31.61 R8.2
  Bottom 0.305: v197.46,32.33 U2.5
SCL_S2
  Top 0.305: SCL_S2_C2.TP 179.17,42.75 180.24,43.81 204.27,43.81 U1.51
SCL_S2_U  (via drill 0.6)
  Top 0.305: v152.27,42.77 157.94,42.77 SCL_S2_C2_C1.TP
  Top 0.406: R10.2 139.57,40.74 v138.28,39.45
  Bottom 0.305: U3.5 139.19,32.41 140.16,33.38 140.16,34.65 140.16,35 140.74,35.58 150.72,35.58 152.27,37.14 v152.27,42.77
  Bottom 0.406: v138.28,39.45 138.28,36.53 140.16,34.65
SCL_S3
  Top 0.305: SCL_S3_C3.TP 181.2,21.08 182.78,19.51 200.85,19.51 U1.12
SCL_S3_U  (via drill 0.6)
  Top 0.305: R27.1 79.63,53.79 v79.65,36.17 79.76,36.27 88.34,36.27 89.92,34.7 89.92,22.43 91.16,21.18 SCL_S3_C3_C2.TP
  Bottom 0.305: U4.5 78.44,35.03 v79.65,36.17
SCL_S4
  Top 0.305: SCL_S4_C4.TP 176.1,37.31 180.82,42.04 201.1,42.04 U1.58
SCL_S4_U
  Top 0.305: X1.7 90.59,51.42 91.59,50.42 94.67,50.42 96.14,48.95 97.08,48.95 97.84,48.18 97.84,38.48 98.98,37.34 102.69,37.34 SCL_S4_C4_C2.TP
SCL_S4_U_1  (via drill 0.6)
  Top 0.305: X2.7 16.07,31.61 16.56,31.11 16.56,26.14 | 16.56,26.14 15.93,25.5 R25.1 | v37.67,33.93 42.32,33.93 43.48,32.77 43.48,18.62 41.27,16.41 20.95,16.41 19,18.36 19,23.7 16.56,26.14
  Bottom 0.305: U5.5 36.82,33.09 v37.67,33.93
SDA_S1  (via drill 0.6)
  Top 0.305: U1.3 205.51,30.58 204.04,29.08 v202.82,29.08 | R6.2 193.67,34.95 v194.34,35.61
  Bottom 0.305: 195.1,34.09 194.67,33.66 194.67,32.39 U2.4 | v202.82,29.08 202.82,32.89 201.62,34.09 195.1,34.09 | v194.34,35.61 194.46,35.61 194.56,35.51 194.56,34.62 195.1,34.09
SDA_S2
  Top 0.305: SDA_S2_C1.TP 177.57,40.06 180.42,42.9 204.48,42.9 U1.52
SDA_S2_U  (via drill 0.6)
  Top 0.305: 136.22,35.48 v136.17,35.43
  Top 0.406: R12.2 143.13,42.14 | 143.13,42.14 143.13,41.81 | 136.22,35.48 140.36,35.48 143.1,38.23 143.1,38.33 | 143.1,38.33 143.1,42.11 143.13,42.14 | SDA_S2_C2_C2.TP 144.81,40.03 143.1,38.33
  Bottom 0.305: v136.17,35.43 136.17,32.44 U3.4
SDA_S3
  Top 0.305: SDA_S3_C1.TP 182.47,18.39 182.78,18.69 200.74,18.69 U1.13
SDA_S3_U  (via drill 0.6)
  Top 0.305: R26.1 77.22,53.86 77.22,51.05 77.67,50.67 v77.67,36.32 77.69,36.31 77.69,35.61 78.52,34.77 87.15,34.77 89.26,32.66 89.26,20.22 91.08,18.39 SDA_S3_C3_C4.TP
  Bottom 0.305: U4.4 77.69,36.31 v77.67,36.32
SDA_S4
  Top 0.305: U1.59 201.2,41.22 181.33,41.22 176.4,36.3 172.57,36.3 170.92,34.65 SDA_S4_C1.TP
SDA_S4_U
  Top 0.305: X1.8 90.18,50.92 90.88,50.22 90.91,50.22 91.62,49.5 94.11,49.5 95.61,48.01 95.61,47.98 96.65,46.94 96.65,36.22 98.09,34.77 102.72,34.77 SDA_S4_C4_C4.TP
SDA_S4_U_1  (via drill 0.6)
  Top 0.305: X2.8 15.19,31.11 15.77,30.53 15.77,27 v15.39,26.62 | R24.1 11.21,23.27 v15.39,23.27 15.54,23.11 15.54,15.82 16.41,14.96 41.73,14.96 44.75,17.98 44.75,33.88 42.54,36.09 37.03,36.09 35.74,34.8 v35.43,34.8
  Bottom 0.305: v15.39,26.62 v15.39,23.27 | U5.4 33.74,33.87 34.62,34.75 35.38,34.75 v35.43,34.8
SWDCLK  (via drill 0.6)
  Top 0.305: R2.2 186.72,53.72 v186.69,54.18 | v212.9,20.52 215.06,20.52 215.72,21.18 215.72,26 U1.21
  Bottom 0.305: v186.69,54.18 186.77,54.1 213.69,54.1 215.14,52.65 215.14,25.91 213.36,24.13 213.31,24.13 212.98,23.8 212.98,20.6 v212.9,20.52
SWDIO  (via drill 0.6)
  Top 0.305: R3.2 189.38,55.58 v189.48,55.68 | U1.20 215.09,25.93 215.09,23.19 214.6,22.71 v214.32,22.71
  Bottom 0.305: v189.48,55.68 214.4,55.68 216.38,53.7 216.41,24.69 v214.32,22.71
VCC_C2  (via drill 0.6)
  Top 0.813: VCC_C2.TP v154.84,50.34 | 120.14,11.41 v119.79,11.25 | IC1.3 135.55,47.21 v135.46,47.12 | 117.58,52.45 v117.6,52.43
  Top 1.27: 145.03,13.31 v145.82,13.82
  Top 1.93: 120.14,11.41 135.86,11.41 138.18,13.28 145.03,13.31
  Top 2.54: VCC_C2_C3.TP 117.58,52.45
  Bottom 0.813: 117.78,47.12 118.29,47.12 118.29,47.07 VCC_3_C2.TP 117.6,47.14 | v119.79,11.25 119.71,11.51 | 150.9,13.82 VCC_4_C2.TP | VCC_2_C2.TP 154.15,47.12 154.79,47.75 154.79,50.29 v154.84,50.34
  Bottom 1.93: 119.71,11.51 VCC_1_C2.TP 116.84,14.91 117.14,45.77 117.78,46.71 117.78,47.12 | VCC_2_C2.TP v135.46,47.12 118.29,47.12 | v145.82,13.82 150.9,13.82
  Bottom 2.54: v117.6,52.43 117.6,47.14
VCC_C3  (via drill 0.6)
  Top 0.305: X1.1 91.3,54.42 v92.68,53.03 | 99.97,53.03 VCC_C3.TP
  Top 2.54: v92.68,53.03 99.97,53.03
  Bottom 0.305: 92.38,52.73 v92.68,53.03
  Bottom 0.813: 92.38,47.12 VCC_3_C3.TP
  Bottom 2.54: 92.38,47.12 92.38,52.73 | VCC_2_C3.TP 92.43,14.1 90.32,11.99 61.47,11.99 VCC_1_C3.TP 59.33,14.1 57.89,15.55 57.89,45.64 VCC_4_C3.TP 59.41,47.12 60.78,48.49 91.01,48.49 VCC_3_C3.TP
VCC_C4  (via drill 0.6)
  Top 0.305: X2.1 12.93,47.78 v13,47.85
  Top 2.54: VCC_REINFORCEMENT.TP v12.29,14.73
  Bottom 0.305: v13,47.85 VCC_4_C4.TP
  Bottom 0.406: 15.49,14.73 VCC_1_C4.TP
  Bottom 2.54: v12.29,14.73 15.49,14.73 | VCC_1_C4.TP 15.57,14.71 17.42,12.85 46.79,12.85 VCC_2_C4.TP 48.64,14.73 49.86,15.95 49.86,46.63 49,47.5 VCC_3_C4.TP 47.14,49.35 16.99,49.35 VCC_4_C4.TP
VCCC  (via drill 0.6)
  Top 0.813: VCC_C1.TP 176.02,50.34 v176.05,50.37
  Bottom 0.406: 207.59,5.94 207.7,5.94
  Bottom 0.61: VCC_2_C1.TP 175.95,14.1
  Bottom 0.813: v176.05,50.37 176.05,47.27 VCC_4_C1.TP
  Bottom 1.93: VCC_3_C1.TP VCC_4_C1.TP VCC_2_C1.TP 190.14,14.1 | 190.14,14.1 VCC_1_C1.TP | DINA.2 213.49,7.09 213.18,7.77 209.42,7.77 | 209.45,7.8 209.42,7.77 | 209.42,7.77 207.59,5.94 | 207.7,5.94 206.3,4.55 193.47,4.55 191.57,6.5 191.57,12.7 190.14,14.1
VCCD
  Top 0.305: U1.48 212.8,39.35 212.12,40.03 212.12,42.56 C7.1
VDDA
  Top 0.305: VDDA_C1.TP 179.7,23.85 183.24,20.32 200.95,20.32 U1.11 208.38,27.77 208.44,27.77 209.85,29.19 209.85,34.69 U1.56
VDDA2  (via drill 0.6)
  Top 0.813: VDDA_C2.TP v154.05,23.85 | v150.24,11.2 147.86,11.2 L1.2
  Bottom 0.813: v154.05,23.85 154.05,12.93 152.32,11.2 v150.24,11.2
VDDD
  Top 0.305: VDDD_C1.TP 168,55.96 182.52,55.96 184.38,54.1 184.38,47.6 186.79,45.19 203.6,45.19 U1.50
VDDD2
  Top 0.813: L2.2 VDDD_C2.TP
VDDIO
  Top 0.305: U1.26 216.53,28.73 216.53,19.63 214.38,17.47 173.05,17.47 171.4,15.82 166.19,15.82 VDDIO_C1.TP
VDDIO2
  Top 0.813: R15.2 151.87,7.49 152.7,8.33 152.7,14.66 153.8,15.75 157.89,15.75 VDDIO_C2.TP
XRES
  Top 0.305: U1.47 213.97,39.7 213.97,46.91 213.33,47.55 210.72,47.55 209.93,48.34 209.93,50.38 R14.2 C10.1 209.94,52.4 R1.2

### Text on the board
bNames: EMERGE FACE 4 | EMERGE FACE 3 | EMERGE FACE 1 | EMERGE FACE 2